# EAGLE schematic 7x7RGB-IR-J010129B (EAGLE 7.7.0)

## Sheet 1 of 2
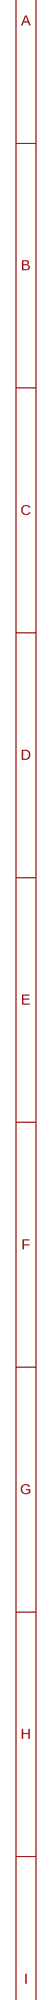
[diagram p0: schematic, sheet 1, part 1 of 2]
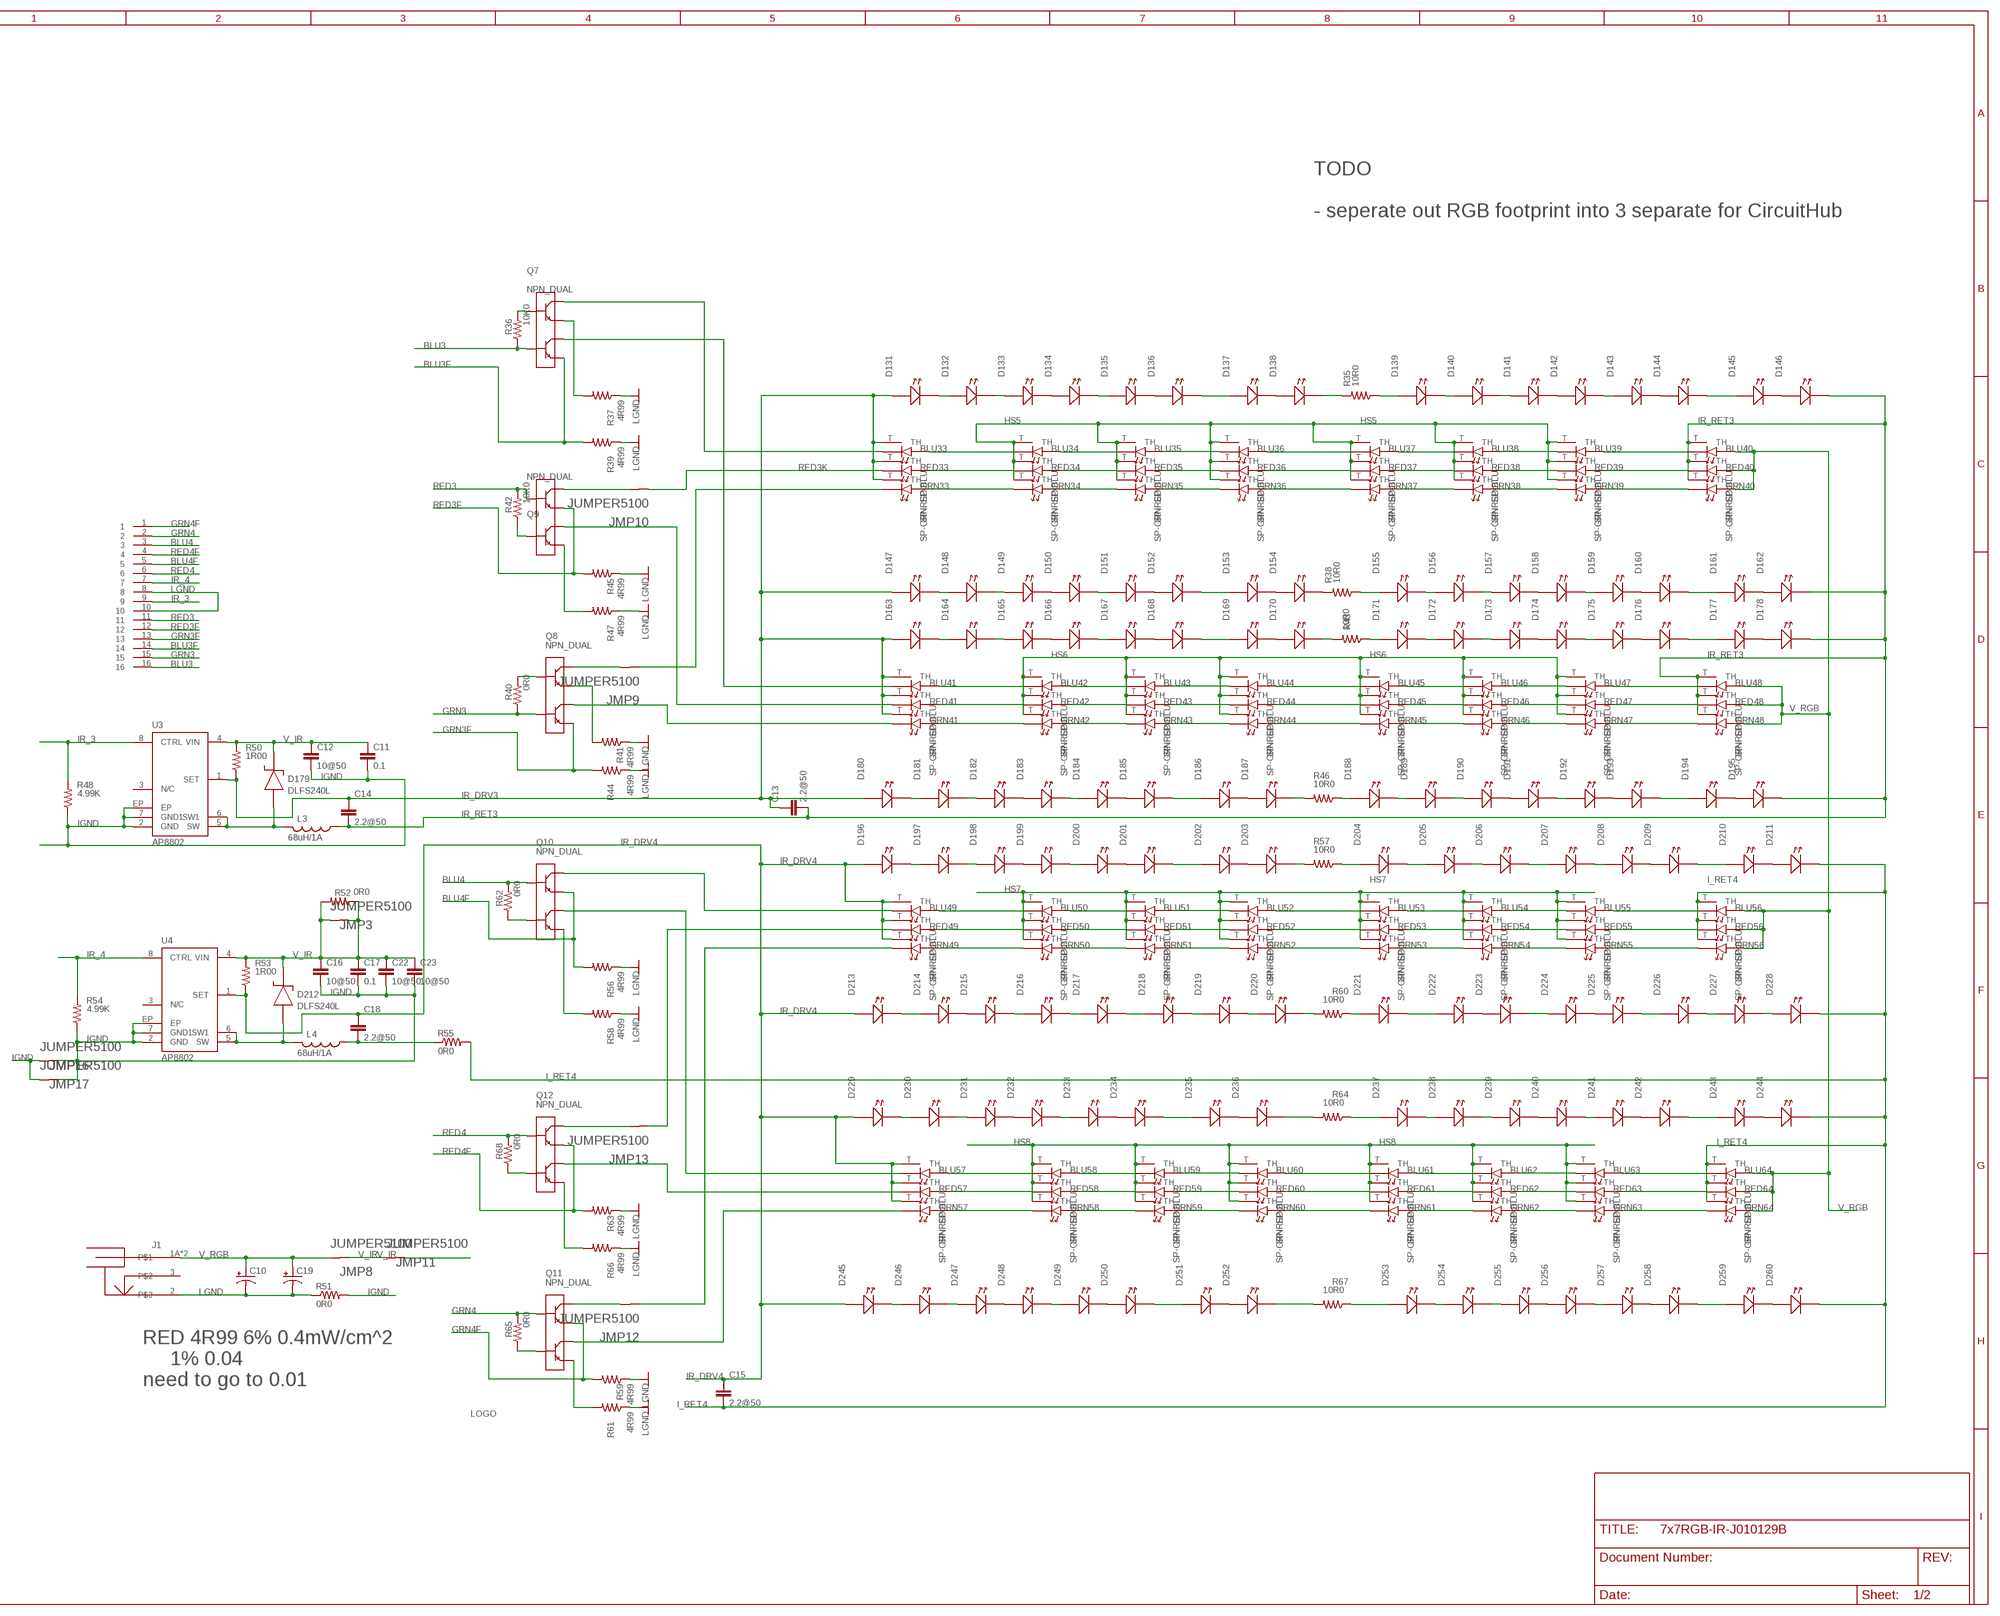
[diagram p1: schematic, sheet 1, part 2 of 2]

### Parts
BLU33  SP-BLU  LED-TH  [SUNPLUS-LED]
BLU34  SP-BLU  LED-TH  [SUNPLUS-LED]
BLU35  SP-BLU  LED-TH  [SUNPLUS-LED]
BLU36  SP-BLU  LED-TH  [SUNPLUS-LED]
BLU37  SP-BLU  LED-TH  [SUNPLUS-LED]
BLU38  SP-BLU  LED-TH  [SUNPLUS-LED]
BLU39  SP-BLU  LED-TH  [SUNPLUS-LED]
BLU40  SP-BLU  LED-TH  [SUNPLUS-LED]
BLU41  SP-BLU  LED-TH  [SUNPLUS-LED]
BLU42  SP-BLU  LED-TH  [SUNPLUS-LED]
BLU43  SP-BLU  LED-TH  [SUNPLUS-LED]
BLU44  SP-BLU  LED-TH  [SUNPLUS-LED]
BLU45  SP-BLU  LED-TH  [SUNPLUS-LED]
BLU46  SP-BLU  LED-TH  [SUNPLUS-LED]
BLU47  SP-BLU  LED-TH  [SUNPLUS-LED]
BLU48  SP-BLU  LED-TH  [SUNPLUS-LED]
BLU49  SP-BLU  LED-TH  [SUNPLUS-LED]
BLU50  SP-BLU  LED-TH  [SUNPLUS-LED]
BLU51  SP-BLU  LED-TH  [SUNPLUS-LED]
BLU52  SP-BLU  LED-TH  [SUNPLUS-LED]
BLU53  SP-BLU  LED-TH  [SUNPLUS-LED]
BLU54  SP-BLU  LED-TH  [SUNPLUS-LED]
BLU55  SP-BLU  LED-TH  [SUNPLUS-LED]
BLU56  SP-BLU  LED-TH  [SUNPLUS-LED]
BLU57  SP-BLU  LED-TH  [SUNPLUS-LED]
BLU58  SP-BLU  LED-TH  [SUNPLUS-LED]
BLU59  SP-BLU  LED-TH  [SUNPLUS-LED]
BLU60  SP-BLU  LED-TH  [SUNPLUS-LED]
BLU61  SP-BLU  LED-TH  [SUNPLUS-LED]
BLU62  SP-BLU  LED-TH  [SUNPLUS-LED]
BLU63  SP-BLU  LED-TH  [SUNPLUS-LED]
BLU64  SP-BLU  LED-TH  [SUNPLUS-LED]
C10  CPOL-US153CLV-0810  [153CLV-0810]
C11  0.1  CAPS0805S  [0805S]
C12  10@50  CAPS1210S  [1210S]
C13  2.2@50  CAPS1206S  [1206S]
C14  2.2@50  CAPS1206S  [1206S]
C15  2.2@50  CAPS1206S  [1206S]
C16  10@50  CAPS1210S  [1210S]
C17  0.1  CAPS0805S  [0805S]
C18  2.2@50  CAPS1206S  [1206S]
C19  CPOL-US153CLV-0810  [153CLV-0810]
C22  10@50  CAPS1210S  [1210S]
C23  10@50  CAPS1210S  [1210S]
D131  LEDLED_SFH4050  [LED_SFH4050]
D132  LEDLED_SFH4050  [LED_SFH4050]
D133  LEDLED_SFH4050  [LED_SFH4050]
D134  LEDLED_SFH4050  [LED_SFH4050]
D135  LEDLED_SFH4050  [LED_SFH4050]
D136  LEDLED_SFH4050  [LED_SFH4050]
D137  LEDLED_SFH4050  [LED_SFH4050]
D138  LEDLED_SFH4050  [LED_SFH4050]
D139  LEDLED_SFH4050  [LED_SFH4050]
D140  LEDLED_SFH4050  [LED_SFH4050]
D141  LEDLED_SFH4050  [LED_SFH4050]
D142  LEDLED_SFH4050  [LED_SFH4050]
D143  LEDLED_SFH4050  [LED_SFH4050]
D144  LEDLED_SFH4050  [LED_SFH4050]
D145  LEDLED_SFH4050  [LED_SFH4050]
D146  LEDLED_SFH4050  [LED_SFH4050]
D147  LEDLED_SFH4050  [LED_SFH4050]
D148  LEDLED_SFH4050  [LED_SFH4050]
D149  LEDLED_SFH4050  [LED_SFH4050]
D150  LEDLED_SFH4050  [LED_SFH4050]
D151  LEDLED_SFH4050  [LED_SFH4050]
D152  LEDLED_SFH4050  [LED_SFH4050]
D153  LEDLED_SFH4050  [LED_SFH4050]
D154  LEDLED_SFH4050  [LED_SFH4050]
D155  LEDLED_SFH4050  [LED_SFH4050]
D156  LEDLED_SFH4050  [LED_SFH4050]
D157  LEDLED_SFH4050  [LED_SFH4050]
D158  LEDLED_SFH4050  [LED_SFH4050]
D159  LEDLED_SFH4050  [LED_SFH4050]
D160  LEDLED_SFH4050  [LED_SFH4050]
D161  LEDLED_SFH4050  [LED_SFH4050]
D162  LEDLED_SFH4050  [LED_SFH4050]
D163  LEDLED_SFH4050  [LED_SFH4050]
D164  LEDLED_SFH4050  [LED_SFH4050]
D165  LEDLED_SFH4050  [LED_SFH4050]
D166  LEDLED_SFH4050  [LED_SFH4050]
D167  LEDLED_SFH4050  [LED_SFH4050]
D168  LEDLED_SFH4050  [LED_SFH4050]
D169  LEDLED_SFH4050  [LED_SFH4050]
D170  LEDLED_SFH4050  [LED_SFH4050]
D171  LEDLED_SFH4050  [LED_SFH4050]
D172  LEDLED_SFH4050  [LED_SFH4050]
D173  LEDLED_SFH4050  [LED_SFH4050]
D174  LEDLED_SFH4050  [LED_SFH4050]
D175  LEDLED_SFH4050  [LED_SFH4050]
D176  LEDLED_SFH4050  [LED_SFH4050]
D177  LEDLED_SFH4050  [LED_SFH4050]
D178  LEDLED_SFH4050  [LED_SFH4050]
D179  DLFS240L  DIODE_SCHOTTKYPWRDI-123  [PWRDI-123]
D180  LEDLED_SFH4050  [LED_SFH4050]
D181  LEDLED_SFH4050  [LED_SFH4050]
D182  LEDLED_SFH4050  [LED_SFH4050]
D183  LEDLED_SFH4050  [LED_SFH4050]
D184  LEDLED_SFH4050  [LED_SFH4050]
D185  LEDLED_SFH4050  [LED_SFH4050]
D186  LEDLED_SFH4050  [LED_SFH4050]
D187  LEDLED_SFH4050  [LED_SFH4050]
D188  LEDLED_SFH4050  [LED_SFH4050]
D189  LEDLED_SFH4050  [LED_SFH4050]
D190  LEDLED_SFH4050  [LED_SFH4050]
D191  LEDLED_SFH4050  [LED_SFH4050]
D192  LEDLED_SFH4050  [LED_SFH4050]
D193  LEDLED_SFH4050  [LED_SFH4050]
D194  LEDLED_SFH4050  [LED_SFH4050]
D195  LEDLED_SFH4050  [LED_SFH4050]
D196  LEDLED_SFH4050  [LED_SFH4050]
D197  LEDLED_SFH4050  [LED_SFH4050]
D198  LEDLED_SFH4050  [LED_SFH4050]
D199  LEDLED_SFH4050  [LED_SFH4050]
D200  LEDLED_SFH4050  [LED_SFH4050]
D201  LEDLED_SFH4050  [LED_SFH4050]
D202  LEDLED_SFH4050  [LED_SFH4050]
D203  LEDLED_SFH4050  [LED_SFH4050]
D204  LEDLED_SFH4050  [LED_SFH4050]
D205  LEDLED_SFH4050  [LED_SFH4050]
D206  LEDLED_SFH4050  [LED_SFH4050]
D207  LEDLED_SFH4050  [LED_SFH4050]
D208  LEDLED_SFH4050  [LED_SFH4050]
D209  LEDLED_SFH4050  [LED_SFH4050]
D210  LEDLED_SFH4050  [LED_SFH4050]
D211  LEDLED_SFH4050  [LED_SFH4050]
D212  DLFS240L  DIODE_SCHOTTKYPWRDI-123  [PWRDI-123]
D213  LEDLED_SFH4050  [LED_SFH4050]
D214  LEDLED_SFH4050  [LED_SFH4050]
D215  LEDLED_SFH4050  [LED_SFH4050]
D216  LEDLED_SFH4050  [LED_SFH4050]
D217  LEDLED_SFH4050  [LED_SFH4050]
D218  LEDLED_SFH4050  [LED_SFH4050]
D219  LEDLED_SFH4050  [LED_SFH4050]
D220  LEDLED_SFH4050  [LED_SFH4050]
D221  LEDLED_SFH4050  [LED_SFH4050]
D222  LEDLED_SFH4050  [LED_SFH4050]
D223  LEDLED_SFH4050  [LED_SFH4050]
D224  LEDLED_SFH4050  [LED_SFH4050]
D225  LEDLED_SFH4050  [LED_SFH4050]
D226  LEDLED_SFH4050  [LED_SFH4050]
D227  LEDLED_SFH4050  [LED_SFH4050]
D228  LEDLED_SFH4050  [LED_SFH4050]
D229  LEDLED_SFH4050  [LED_SFH4050]
D230  LEDLED_SFH4050  [LED_SFH4050]
D231  LEDLED_SFH4050  [LED_SFH4050]
D232  LEDLED_SFH4050  [LED_SFH4050]
D233  LEDLED_SFH4050  [LED_SFH4050]
D234  LEDLED_SFH4050  [LED_SFH4050]
D235  LEDLED_SFH4050  [LED_SFH4050]
D236  LEDLED_SFH4050  [LED_SFH4050]
D237  LEDLED_SFH4050  [LED_SFH4050]
D238  LEDLED_SFH4050  [LED_SFH4050]
D239  LEDLED_SFH4050  [LED_SFH4050]
D240  LEDLED_SFH4050  [LED_SFH4050]
D241  LEDLED_SFH4050  [LED_SFH4050]
D242  LEDLED_SFH4050  [LED_SFH4050]
D243  LEDLED_SFH4050  [LED_SFH4050]
D244  LEDLED_SFH4050  [LED_SFH4050]
D245  LEDLED_SFH4050  [LED_SFH4050]
D246  LEDLED_SFH4050  [LED_SFH4050]
D247  LEDLED_SFH4050  [LED_SFH4050]
D248  LEDLED_SFH4050  [LED_SFH4050]
D249  LEDLED_SFH4050  [LED_SFH4050]
D250  LEDLED_SFH4050  [LED_SFH4050]
D251  LEDLED_SFH4050  [LED_SFH4050]
D252  LEDLED_SFH4050  [LED_SFH4050]
D253  LEDLED_SFH4050  [LED_SFH4050]
D254  LEDLED_SFH4050  [LED_SFH4050]
D255  LEDLED_SFH4050  [LED_SFH4050]
D256  LEDLED_SFH4050  [LED_SFH4050]
D257  LEDLED_SFH4050  [LED_SFH4050]
D258  LEDLED_SFH4050  [LED_SFH4050]
D259  LEDLED_SFH4050  [LED_SFH4050]
D260  LEDLED_SFH4050  [LED_SFH4050]
GRN33  SP-GRN  LED-TH  [SUNPLUS-LED]
GRN34  SP-GRN  LED-TH  [SUNPLUS-LED]
GRN35  SP-GRN  LED-TH  [SUNPLUS-LED]
GRN36  SP-GRN  LED-TH  [SUNPLUS-LED]
GRN37  SP-GRN  LED-TH  [SUNPLUS-LED]
GRN38  SP-GRN  LED-TH  [SUNPLUS-LED]
GRN39  SP-GRN  LED-TH  [SUNPLUS-LED]
GRN40  SP-GRN  LED-TH  [SUNPLUS-LED]
GRN41  SP-GRN  LED-TH  [SUNPLUS-LED]
GRN42  SP-GRN  LED-TH  [SUNPLUS-LED]
GRN43  SP-GRN  LED-TH  [SUNPLUS-LED]
GRN44  SP-GRN  LED-TH  [SUNPLUS-LED]
GRN45  SP-GRN  LED-TH  [SUNPLUS-LED]
GRN46  SP-GRN  LED-TH  [SUNPLUS-LED]
GRN47  SP-GRN  LED-TH  [SUNPLUS-LED]
GRN48  SP-GRN  LED-TH  [SUNPLUS-LED]
GRN49  SP-GRN  LED-TH  [SUNPLUS-LED]
GRN50  SP-GRN  LED-TH  [SUNPLUS-LED]
GRN51  SP-GRN  LED-TH  [SUNPLUS-LED]
GRN52  SP-GRN  LED-TH  [SUNPLUS-LED]
GRN53  SP-GRN  LED-TH  [SUNPLUS-LED]
GRN54  SP-GRN  LED-TH  [SUNPLUS-LED]
GRN55  SP-GRN  LED-TH  [SUNPLUS-LED]
GRN56  SP-GRN  LED-TH  [SUNPLUS-LED]
GRN57  SP-GRN  LED-TH  [SUNPLUS-LED]
GRN58  SP-GRN  LED-TH  [SUNPLUS-LED]
GRN59  SP-GRN  LED-TH  [SUNPLUS-LED]
GRN60  SP-GRN  LED-TH  [SUNPLUS-LED]
GRN61  SP-GRN  LED-TH  [SUNPLUS-LED]
GRN62  SP-GRN  LED-TH  [SUNPLUS-LED]
GRN63  SP-GRN  LED-TH  [SUNPLUS-LED]
GRN64  SP-GRN  LED-TH  [SUNPLUS-LED]
J1  POWER_JACK_SHUNTPJ-002  [PJ-002]
JMP3  JUMPER5100  [5100]
JMP8  JUMPER5100  [5100]
JMP9  JUMPER5100  [5100]
JMP10  JUMPER5100  [5100]
JMP11  JUMPER5100  [5100]
JMP12  JUMPER5100  [5100]
JMP13  JUMPER5100  [5100]
JMP16  JUMPER5100  [5100]
JMP17  JUMPER5100  [5100]
L3  68uH/1A  INDUCTOR_SMSRU8043  [SRU8043]
L4  68uH/1A  INDUCTOR_SMSRU8043  [SRU8043]
P2  CON162X8SM-SMALL  [HEADER2X8_SM_SMALL]
Q7  NPN_DUAL  [LFPAK56D]
Q8  NPN_DUAL  [LFPAK56D]
Q9  NPN_DUAL  [LFPAK56D]
Q10  NPN_DUAL  [LFPAK56D]
Q11  NPN_DUAL  [LFPAK56D]
Q12  NPN_DUAL  [LFPAK56D]
R35  10R0  RESISTOR_SM1206S  [1206S]
R36  10K0  RESISTOR_SM1206S  [1206S]
R37  4R99  R-US_R2512  [R2512]
R38  10R0  RESISTOR_SM1206S  [1206S]
R39  4R99  R-US_R2512  [R2512]
R40  0R0  RESISTOR_SM1206S  [1206S]
R41  4R99  R-US_R2512  [R2512]
R42  10K0  RESISTOR_SM1206S  [1206S]
R43  10R0  RESISTOR_SM1206S  [1206S]
R44  4R99  R-US_R2512  [R2512]
R45  4R99  R-US_R2512  [R2512]
R46  10R0  RESISTOR_SM1206S  [1206S]
R47  4R99  R-US_R2512  [R2512]
R48  4.99K  RESISTOR_SM0805S  [0805S]
R50  1R00  RESISTOR_SM1206S  [1206S]
R51  0R0  RESISTOR_SM1206S  [1206S]
R52  0R0  RESISTOR_SM1206S  [1206S]
R53  1R00  RESISTOR_SM1206S  [1206S]
R54  4.99K  RESISTOR_SM0805S  [0805S]
R55  0R0  RESISTOR_SM1206S  [1206S]
R56  4R99  R-US_R2512  [R2512]
R57  10R0  RESISTOR_SM1206S  [1206S]
R58  4R99  R-US_R2512  [R2512]
R59  4R99  R-US_R2512  [R2512]
R60  10R0  RESISTOR_SM1206S  [1206S]
R61  4R99  R-US_R2512  [R2512]
R62  0R0  RESISTOR_SM1206S  [1206S]
R63  4R99  R-US_R2512  [R2512]
R64  10R0  RESISTOR_SM1206S  [1206S]
R65  0R0  RESISTOR_SM1206S  [1206S]
R66  4R99  R-US_R2512  [R2512]
R67  10R0  RESISTOR_SM1206S  [1206S]
R68  0R0  RESISTOR_SM1206S  [1206S]
RED33  SP-RED  LED-TH  [SUNPLUS-LED]
RED34  SP-RED  LED-TH  [SUNPLUS-LED]
RED35  SP-RED  LED-TH  [SUNPLUS-LED]
RED36  SP-RED  LED-TH  [SUNPLUS-LED]
RED37  SP-RED  LED-TH  [SUNPLUS-LED]
RED38  SP-RED  LED-TH  [SUNPLUS-LED]
RED39  SP-RED  LED-TH  [SUNPLUS-LED]
RED40  SP-RED  LED-TH  [SUNPLUS-LED]
RED41  SP-RED  LED-TH  [SUNPLUS-LED]
RED42  SP-RED  LED-TH  [SUNPLUS-LED]
RED43  SP-RED  LED-TH  [SUNPLUS-LED]
RED44  SP-RED  LED-TH  [SUNPLUS-LED]
RED45  SP-RED  LED-TH  [SUNPLUS-LED]
RED46  SP-RED  LED-TH  [SUNPLUS-LED]
RED47  SP-RED  LED-TH  [SUNPLUS-LED]
RED48  SP-RED  LED-TH  [SUNPLUS-LED]
RED49  SP-RED  LED-TH  [SUNPLUS-LED]
RED50  SP-RED  LED-TH  [SUNPLUS-LED]
RED51  SP-RED  LED-TH  [SUNPLUS-LED]
RED52  SP-RED  LED-TH  [SUNPLUS-LED]
RED53  SP-RED  LED-TH  [SUNPLUS-LED]
RED54  SP-RED  LED-TH  [SUNPLUS-LED]
RED55  SP-RED  LED-TH  [SUNPLUS-LED]
RED56  SP-RED  LED-TH  [SUNPLUS-LED]
RED57  SP-RED  LED-TH  [SUNPLUS-LED]
RED58  SP-RED  LED-TH  [SUNPLUS-LED]
RED59  SP-RED  LED-TH  [SUNPLUS-LED]
RED60  SP-RED  LED-TH  [SUNPLUS-LED]
RED61  SP-RED  LED-TH  [SUNPLUS-LED]
RED62  SP-RED  LED-TH  [SUNPLUS-LED]
RED63  SP-RED  LED-TH  [SUNPLUS-LED]
RED64  SP-RED  LED-TH  [SUNPLUS-LED]
U3  AP8802  [SOIC8-EP]
U4  AP8802  [SOIC8-EP]
U$19  JFRC-LOGOLOGO_OP  [LOGO_BMP_OP]

### Nets
BLU3: P2.16 Q7.4(B2) R36.1
BLU3F: P2.14 Q7.3(E2) R39.2
BLU3K: BLU33.GC(K) Q7.7(C1) Q7.8(C1) Q7.78(C1)
BLU4: P2.3 Q10.2(B1) R62.2
BLU4F: P2.5 Q10.1(E1) R56.2
G4: Q11.3(E2) R61.2
G4A: Q11.4(B2) R65.1
GRN3: P2.15 Q8.4(B2) R40.1
GRN3F: P2.13 Q8.3(E2) R44.2
GRN3K: GRN33.GC(K) JMP9.1
GRN4: P2.2 Q11.2(B1) R65.2
GRN4F: P2.1 Q11.1(E1) R59.2
GULA_1: GRN57.GC(K) Q11.5(C2) Q11.6(C2) Q11.56(C2)
GULA_2: Q12.5(C2) Q12.6(C2) Q12.56(C2) RED57.GC(K)
GULA_3: GRN41.GC(K) Q8.5(C2) Q8.6(C2) Q8.56(C2)
GULA_4: Q9.5(C2) Q9.6(C2) Q9.56(C2) RED41.GC(K)
HS5: BLU34.T(TH) BLU35.T(TH) BLU36.T(TH) BLU37.T(TH) BLU38.T(TH) BLU39.T(TH) GRN34.T(TH) GRN35.T(TH) GRN36.T(TH) GRN37.T(TH) GRN38.T(TH) GRN39.T(TH) RED34.T(TH) RED35.T(TH) RED36.T(TH) RED37.T(TH) RED38.T(TH) RED39.T(TH)
HS6: BLU42.T(TH) BLU43.T(TH) BLU44.T(TH) BLU45.T(TH) BLU46.T(TH) BLU47.T(TH) GRN42.T(TH) GRN43.T(TH) GRN44.T(TH) GRN45.T(TH) GRN46.T(TH) GRN47.T(TH) RED42.T(TH) RED43.T(TH) RED44.T(TH) RED45.T(TH) RED46.T(TH) RED47.T(TH)
HS7: BLU50.T(TH) BLU51.T(TH) BLU52.T(TH) BLU53.T(TH) BLU54.T(TH) BLU55.T(TH) GRN50.T(TH) GRN51.T(TH) GRN52.T(TH) GRN53.T(TH) GRN54.T(TH) GRN55.T(TH) RED50.T(TH) RED51.T(TH) RED52.T(TH) RED53.T(TH) RED54.T(TH) RED55.T(TH)
HS8: BLU58.T(TH) BLU59.T(TH) BLU60.T(TH) BLU61.T(TH) BLU62.T(TH) BLU63.T(TH) GRN58.T(TH) GRN59.T(TH) GRN60.T(TH) GRN61.T(TH) GRN62.T(TH) GRN63.T(TH) RED58.T(TH) RED59.T(TH) RED60.T(TH) RED61.T(TH) RED62.T(TH) RED63.T(TH)
I_RET4: BLU56.T(TH) BLU64.T(TH) C15.2 D211.C(K) D228.C(K) D244.C(K) D260.C(K) GRN56.T(TH) GRN64.T(TH) R55.2 RED56.T(TH) RED64.T(TH)
IGND: C11.2 C12.2 C16.2 C17.2 C22.2 C23.2 JMP16.1 JMP16.2 JMP17.1 JMP17.2 R48.1 R51.2 R54.1 U3.2(GND) U3.7(GND1) U3.EP U4.2(GND) U4.7(GND1) U4.EP
IR_3: P2.9 R48.2 U3.8(CTRL)
IR_4: P2.7 R54.2 U4.8(CTRL)
IR_DRV3: BLU33.T(TH) BLU41.T(TH) C13.1 C14.1 D131.A D147.A D163.A D180.A GRN33.T(TH) GRN41.T(TH) R50.1 RED33.T(TH) RED41.T(TH) U3.1(SET)
IR_DRV4: BLU49.T(TH) BLU57.T(TH) C15.1 C18.1 D196.A D213.A D229.A D245.A GRN49.T(TH) GRN57.T(TH) R53.1 RED49.T(TH) RED57.T(TH) U4.1(SET)
IR_RET3: BLU40.T(TH) BLU48.T(TH) C13.2 C14.2 D146.C(K) D162.C(K) D178.C(K) D195.C(K) GRN40.T(TH) GRN48.T(TH) L3.1 RED40.T(TH) RED48.T(TH)
LGND: C10.- C19.- J1.2 P2.8 P2.10 R37.1 R39.1 R41.1 R44.1 R45.1 R47.1 R51.1 R56.1 R58.1 R59.1 R61.1 R63.1 R66.1 ; also sheet 2
N$2: D227.C(K) D228.A
N$3: Q12.4(B2) R68.1
N$4: Q8.1(E1) R41.2
N$5: GRN49.GC(K) JMP12.1
N$6: BLU49.GC(K) Q10.7(C1) Q10.8(C1) Q10.78(C1)
N$8: BLU57.GC(K) Q10.5(C2) Q10.6(C2) Q10.56(C2)
N$9: Q9.3(E2) R47.2
N$10: Q9.4(B2) R42.1
N$11: Q8.2(B1) R40.2
N$14: D139.A R35.1
N$15: JMP13.2 Q12.7(C1) Q12.8(C1) Q12.78(C1)
N$16: JMP12.2 Q11.7(C1) Q11.8(C1) Q11.78(C1)
N$17: D138.C(K) R35.2
N$18: D154.C(K) R38.2
N$19: D155.A R38.1
N$20: JMP13.1 RED49.GC(K)
N$21: D171.A R43.1
N$22: D170.C(K) R43.2
N$23: D188.A R46.1
N$24: D187.C(K) R46.2
N$25: D203.C(K) R57.2
N$26: GRN58.GA(A) GRN59.GC(K)
N$27: D212.A L4.2 U4.5(SW) U4.6(SW1)
N$29: C18.2 L4.1 R55.1
N$30: GRN57.GA(A) GRN58.GC(K)
N$31: D204.A R57.1
N$32: D221.A R60.1
N$33: D220.C(K) R60.2
N$34: D237.A R64.1
N$35: Q10.4(B2) R62.1
N$36: Q10.3(E2) R58.2
N$37: D236.C(K) R64.2
N$38: D253.A R67.1
N$39: D252.C(K) R67.2
N$67: D179.A L3.2 U3.5(SW) U3.6(SW1)
N$97: GRN42.GA(A) GRN43.GC(K)
N$177: GRN41.GA(A) GRN42.GC(K)
N$178: RED42.GA(A) RED43.GC(K)
N$179: RED41.GA(A) RED42.GC(K)
N$181: BLU41.GA(A) BLU42.GC(K)
N$188: BLU42.GA(A) BLU43.GC(K)
N$190: RED58.GA(A) RED59.GC(K)
N$208: GRN34.GA(A) GRN35.GC(K)
N$230: GRN45.GA(A) GRN46.GC(K)
N$233: GRN44.GA(A) GRN45.GC(K)
N$235: RED45.GA(A) RED46.GC(K)
N$238: RED44.GA(A) RED45.GC(K)
N$239: BLU44.GA(A) BLU45.GC(K)
N$240: BLU45.GA(A) BLU46.GC(K)
N$241: GRN47.GA(A) GRN48.GC(K)
N$242: RED47.GA(A) RED48.GC(K)
N$243: BLU47.GA(A) BLU48.GC(K)
N$244: BLU43.GA(A) BLU44.GC(K)
N$245: RED43.GA(A) RED44.GC(K)
N$248: GRN43.GA(A) GRN44.GC(K)
N$249: GRN50.GA(A) GRN51.GC(K)
N$250: BLU46.GA(A) BLU47.GC(K)
N$251: RED46.GA(A) RED47.GC(K)
N$256: D181.C(K) D182.A
N$257: D182.C(K) D183.A
N$261: GRN33.GA(A) GRN34.GC(K)
N$262: RED34.GA(A) RED35.GC(K)
N$264: D184.C(K) D185.A
N$265: D186.C(K) D187.A
N$267: RED33.GA(A) RED34.GC(K)
N$268: D180.C(K) D181.A
N$269: D183.C(K) D184.A
N$270: D185.C(K) D186.A
N$271: D189.C(K) D190.A
N$272: D190.C(K) D191.A
N$273: D192.C(K) D193.A
N$274: D194.C(K) D195.A
N$275: D188.C(K) D189.A
N$276: D191.C(K) D192.A
N$277: D193.C(K) D194.A
N$278: D164.C(K) D165.A
N$279: D165.C(K) D166.A
N$280: D167.C(K) D168.A
N$281: D169.C(K) D170.A
N$282: D163.C(K) D164.A
N$283: D166.C(K) D167.A
N$284: D168.C(K) D169.A
N$285: D172.C(K) D173.A
N$286: D173.C(K) D174.A
N$287: D175.C(K) D176.A
N$288: D177.C(K) D178.A
N$289: D171.C(K) D172.A
N$290: D174.C(K) D175.A
N$291: D176.C(K) D177.A
N$292: BLU33.GA(A) BLU34.GC(K)
N$294: GRN49.GA(A) GRN50.GC(K)
N$295: RED50.GA(A) RED51.GC(K)
N$296: RED49.GA(A) RED50.GC(K)
N$297: BLU49.GA(A) BLU50.GC(K)
N$298: BLU50.GA(A) BLU51.GC(K)
N$299: GRN53.GA(A) GRN54.GC(K)
N$300: GRN52.GA(A) GRN53.GC(K)
N$301: RED53.GA(A) RED54.GC(K)
N$302: RED52.GA(A) RED53.GC(K)
N$303: BLU52.GA(A) BLU53.GC(K)
N$304: BLU53.GA(A) BLU54.GC(K)
N$305: GRN55.GA(A) GRN56.GC(K)
N$306: RED55.GA(A) RED56.GC(K)
N$307: BLU55.GA(A) BLU56.GC(K)
N$308: BLU51.GA(A) BLU52.GC(K)
N$309: RED51.GA(A) RED52.GC(K)
N$310: GRN51.GA(A) GRN52.GC(K)
N$311: RED57.GA(A) RED58.GC(K)
N$312: BLU54.GA(A) BLU55.GC(K)
N$313: RED54.GA(A) RED55.GC(K)
N$314: GRN54.GA(A) GRN55.GC(K)
N$315: D197.C(K) D198.A
N$316: D198.C(K) D199.A
N$317: D200.C(K) D201.A
N$318: D202.C(K) D203.A
N$319: D196.C(K) D197.A
N$320: D199.C(K) D200.A
N$321: D201.C(K) D202.A
N$322: D205.C(K) D206.A
N$323: D206.C(K) D207.A
N$324: D208.C(K) D209.A
N$325: D210.C(K) D211.A
N$326: D204.C(K) D205.A
N$327: D207.C(K) D208.A
N$328: D209.C(K) D210.A
N$329: D214.C(K) D215.A
N$330: D215.C(K) D216.A
N$331: D217.C(K) D218.A
N$332: D219.C(K) D220.A
N$333: D213.C(K) D214.A
N$334: D216.C(K) D217.A
N$335: D218.C(K) D219.A
N$336: D222.C(K) D223.A
N$337: D224.C(K) D225.A
N$338: D226.C(K) D227.A
N$339: D221.C(K) D222.A
N$340: D223.C(K) D224.A
N$341: D225.C(K) D226.A
N$344: BLU34.GA(A) BLU35.GC(K)
N$345: GRN37.GA(A) GRN38.GC(K)
N$346: GRN36.GA(A) GRN37.GC(K)
N$347: RED37.GA(A) RED38.GC(K)
N$348: RED36.GA(A) RED37.GC(K)
N$349: BLU36.GA(A) BLU37.GC(K)
N$350: BLU37.GA(A) BLU38.GC(K)
N$351: GRN39.GA(A) GRN40.GC(K)
N$352: RED39.GA(A) RED40.GC(K)
N$353: BLU39.GA(A) BLU40.GC(K)
N$354: BLU35.GA(A) BLU36.GC(K)
N$355: RED35.GA(A) RED36.GC(K)
N$356: GRN35.GA(A) GRN36.GC(K)
N$357: GRN46.GA(A) GRN47.GC(K)
N$358: BLU38.GA(A) BLU39.GC(K)
N$359: RED38.GA(A) RED39.GC(K)
N$360: GRN38.GA(A) GRN39.GC(K)
N$361: BLU57.GA(A) BLU58.GC(K)
N$362: BLU58.GA(A) BLU59.GC(K)
N$363: GRN61.GA(A) GRN62.GC(K)
N$364: GRN60.GA(A) GRN61.GC(K)
N$365: D132.C(K) D133.A
N$366: D133.C(K) D134.A
N$367: D135.C(K) D136.A
N$368: D137.C(K) D138.A
N$369: D131.C(K) D132.A
N$370: D134.C(K) D135.A
N$371: D136.C(K) D137.A
N$372: D140.C(K) D141.A
N$373: D141.C(K) D142.A
N$374: D143.C(K) D144.A
N$375: D145.C(K) D146.A
N$376: D139.C(K) D140.A
N$377: D142.C(K) D143.A
N$378: D144.C(K) D145.A
N$379: D148.C(K) D149.A
N$380: D149.C(K) D150.A
N$381: D151.C(K) D152.A
N$382: D153.C(K) D154.A
N$383: D147.C(K) D148.A
N$384: D150.C(K) D151.A
N$385: D152.C(K) D153.A
N$386: D156.C(K) D157.A
N$387: D157.C(K) D158.A
N$388: D159.C(K) D160.A
N$389: D161.C(K) D162.A
N$390: D155.C(K) D156.A
N$391: D158.C(K) D159.A
N$392: D160.C(K) D161.A
N$400: Q7.1(E1) R37.2
N$401: BLU41.GC(K) Q7.5(C2) Q7.6(C2) Q7.56(C2)
N$403: RED61.GA(A) RED62.GC(K)
N$404: RED60.GA(A) RED61.GC(K)
N$405: BLU60.GA(A) BLU61.GC(K)
N$406: BLU61.GA(A) BLU62.GC(K)
N$407: GRN63.GA(A) GRN64.GC(K)
N$408: RED63.GA(A) RED64.GC(K)
N$409: BLU63.GA(A) BLU64.GC(K)
N$410: BLU59.GA(A) BLU60.GC(K)
N$411: RED59.GA(A) RED60.GC(K)
N$412: GRN59.GA(A) GRN60.GC(K)
N$414: BLU62.GA(A) BLU63.GC(K)
N$415: RED62.GA(A) RED63.GC(K)
N$416: GRN62.GA(A) GRN63.GC(K)
N$424: D230.C(K) D231.A
N$425: D231.C(K) D232.A
N$426: D233.C(K) D234.A
N$427: D235.C(K) D236.A
N$428: D229.C(K) D230.A
N$429: D232.C(K) D233.A
N$430: D234.C(K) D235.A
N$431: D238.C(K) D239.A
N$432: D239.C(K) D240.A
N$433: D241.C(K) D242.A
N$434: D243.C(K) D244.A
N$435: D237.C(K) D238.A
N$436: D240.C(K) D241.A
N$437: D242.C(K) D243.A
N$438: D246.C(K) D247.A
N$439: D247.C(K) D248.A
N$440: D249.C(K) D250.A
N$441: D251.C(K) D252.A
N$442: D245.C(K) D246.A
N$443: D248.C(K) D249.A
N$444: D250.C(K) D251.A
N$445: D254.C(K) D255.A
N$446: D255.C(K) D256.A
N$447: D257.C(K) D258.A
N$448: D259.C(K) D260.A
N$449: D253.C(K) D254.A
N$450: D256.C(K) D257.A
N$451: D258.C(K) D259.A
N$481: JMP10.2 Q9.7(C1) Q9.8(C1) Q9.78(C1)
N$482: JMP9.2 Q8.7(C1) Q8.8(C1) Q8.78(C1)
N$484: Q7.2(B1) R36.2
R4: Q12.3(E2) R66.2
RED3: P2.11 Q9.2(B1) R42.2
RED3F: P2.12 Q9.1(E1) R45.2
RED3K: JMP10.1 RED33.GC(K)
RED4: P2.6 Q12.2(B1) R68.2
RED4F: P2.4 Q12.1(E1) R63.2
V_IR: C11.1 C12.1 C16.1 C17.1 C22.1 C23.1 D179.K D212.K JMP3.1 JMP3.2 JMP8.2 JMP11.1 JMP11.2 R50.2 R52.1 R52.2 R53.2 U3.4(VIN) U4.4(VIN)
V_RGB: BLU40.GA(A) BLU48.GA(A) BLU56.GA(A) BLU64.GA(A) C10.+ C19.+ GRN40.GA(A) GRN48.GA(A) GRN56.GA(A) GRN64.GA(A) J1.1A J1.1B JMP8.1 RED40.GA(A) RED48.GA(A) RED56.GA(A) RED64.GA(A) ; also sheet 2
Unconnected: J1.3 U3.3(N/C) U4.3(N/C)

### Notes on the sheet
- TODO
  
  - seperate out RGB footprint into 3 separate for CircuitHub
- RED 4R99 6% 0.4mW/cm^2
       1% 0.04
  need to go to 0.01

## Sheet 2 of 2
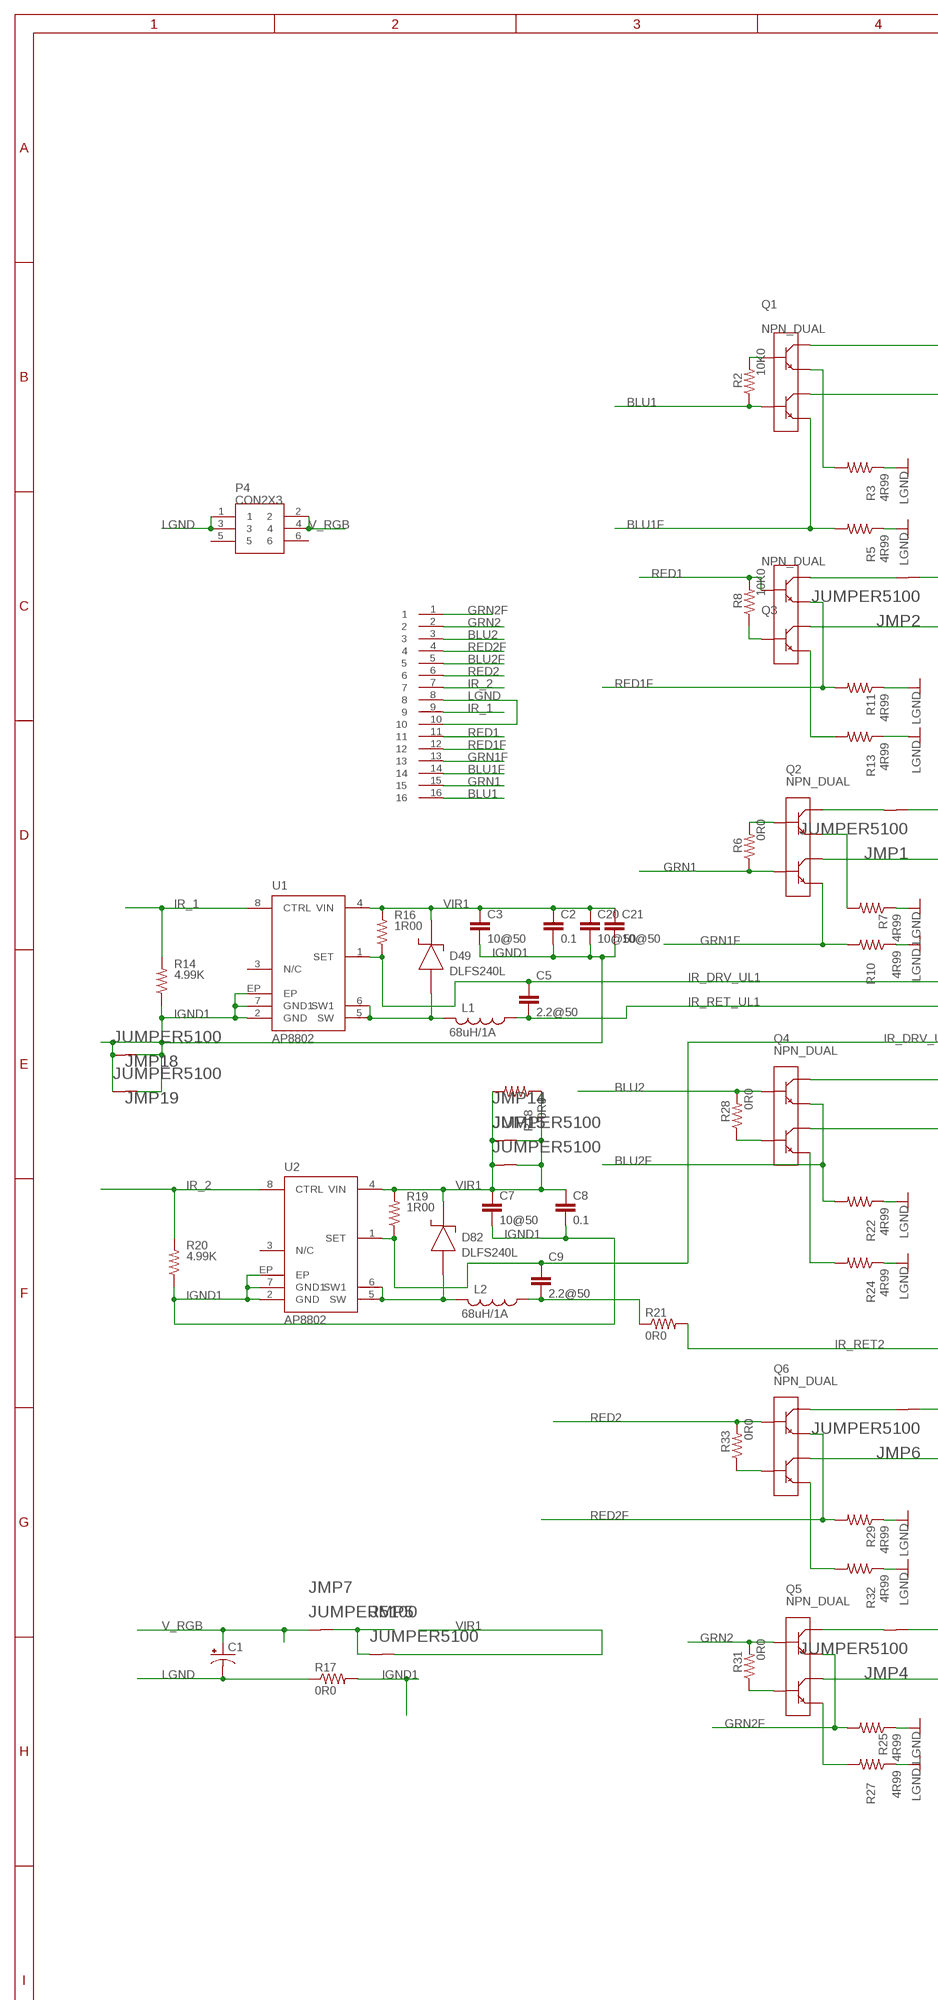
[diagram p2: schematic, sheet 2, part 1 of 2]
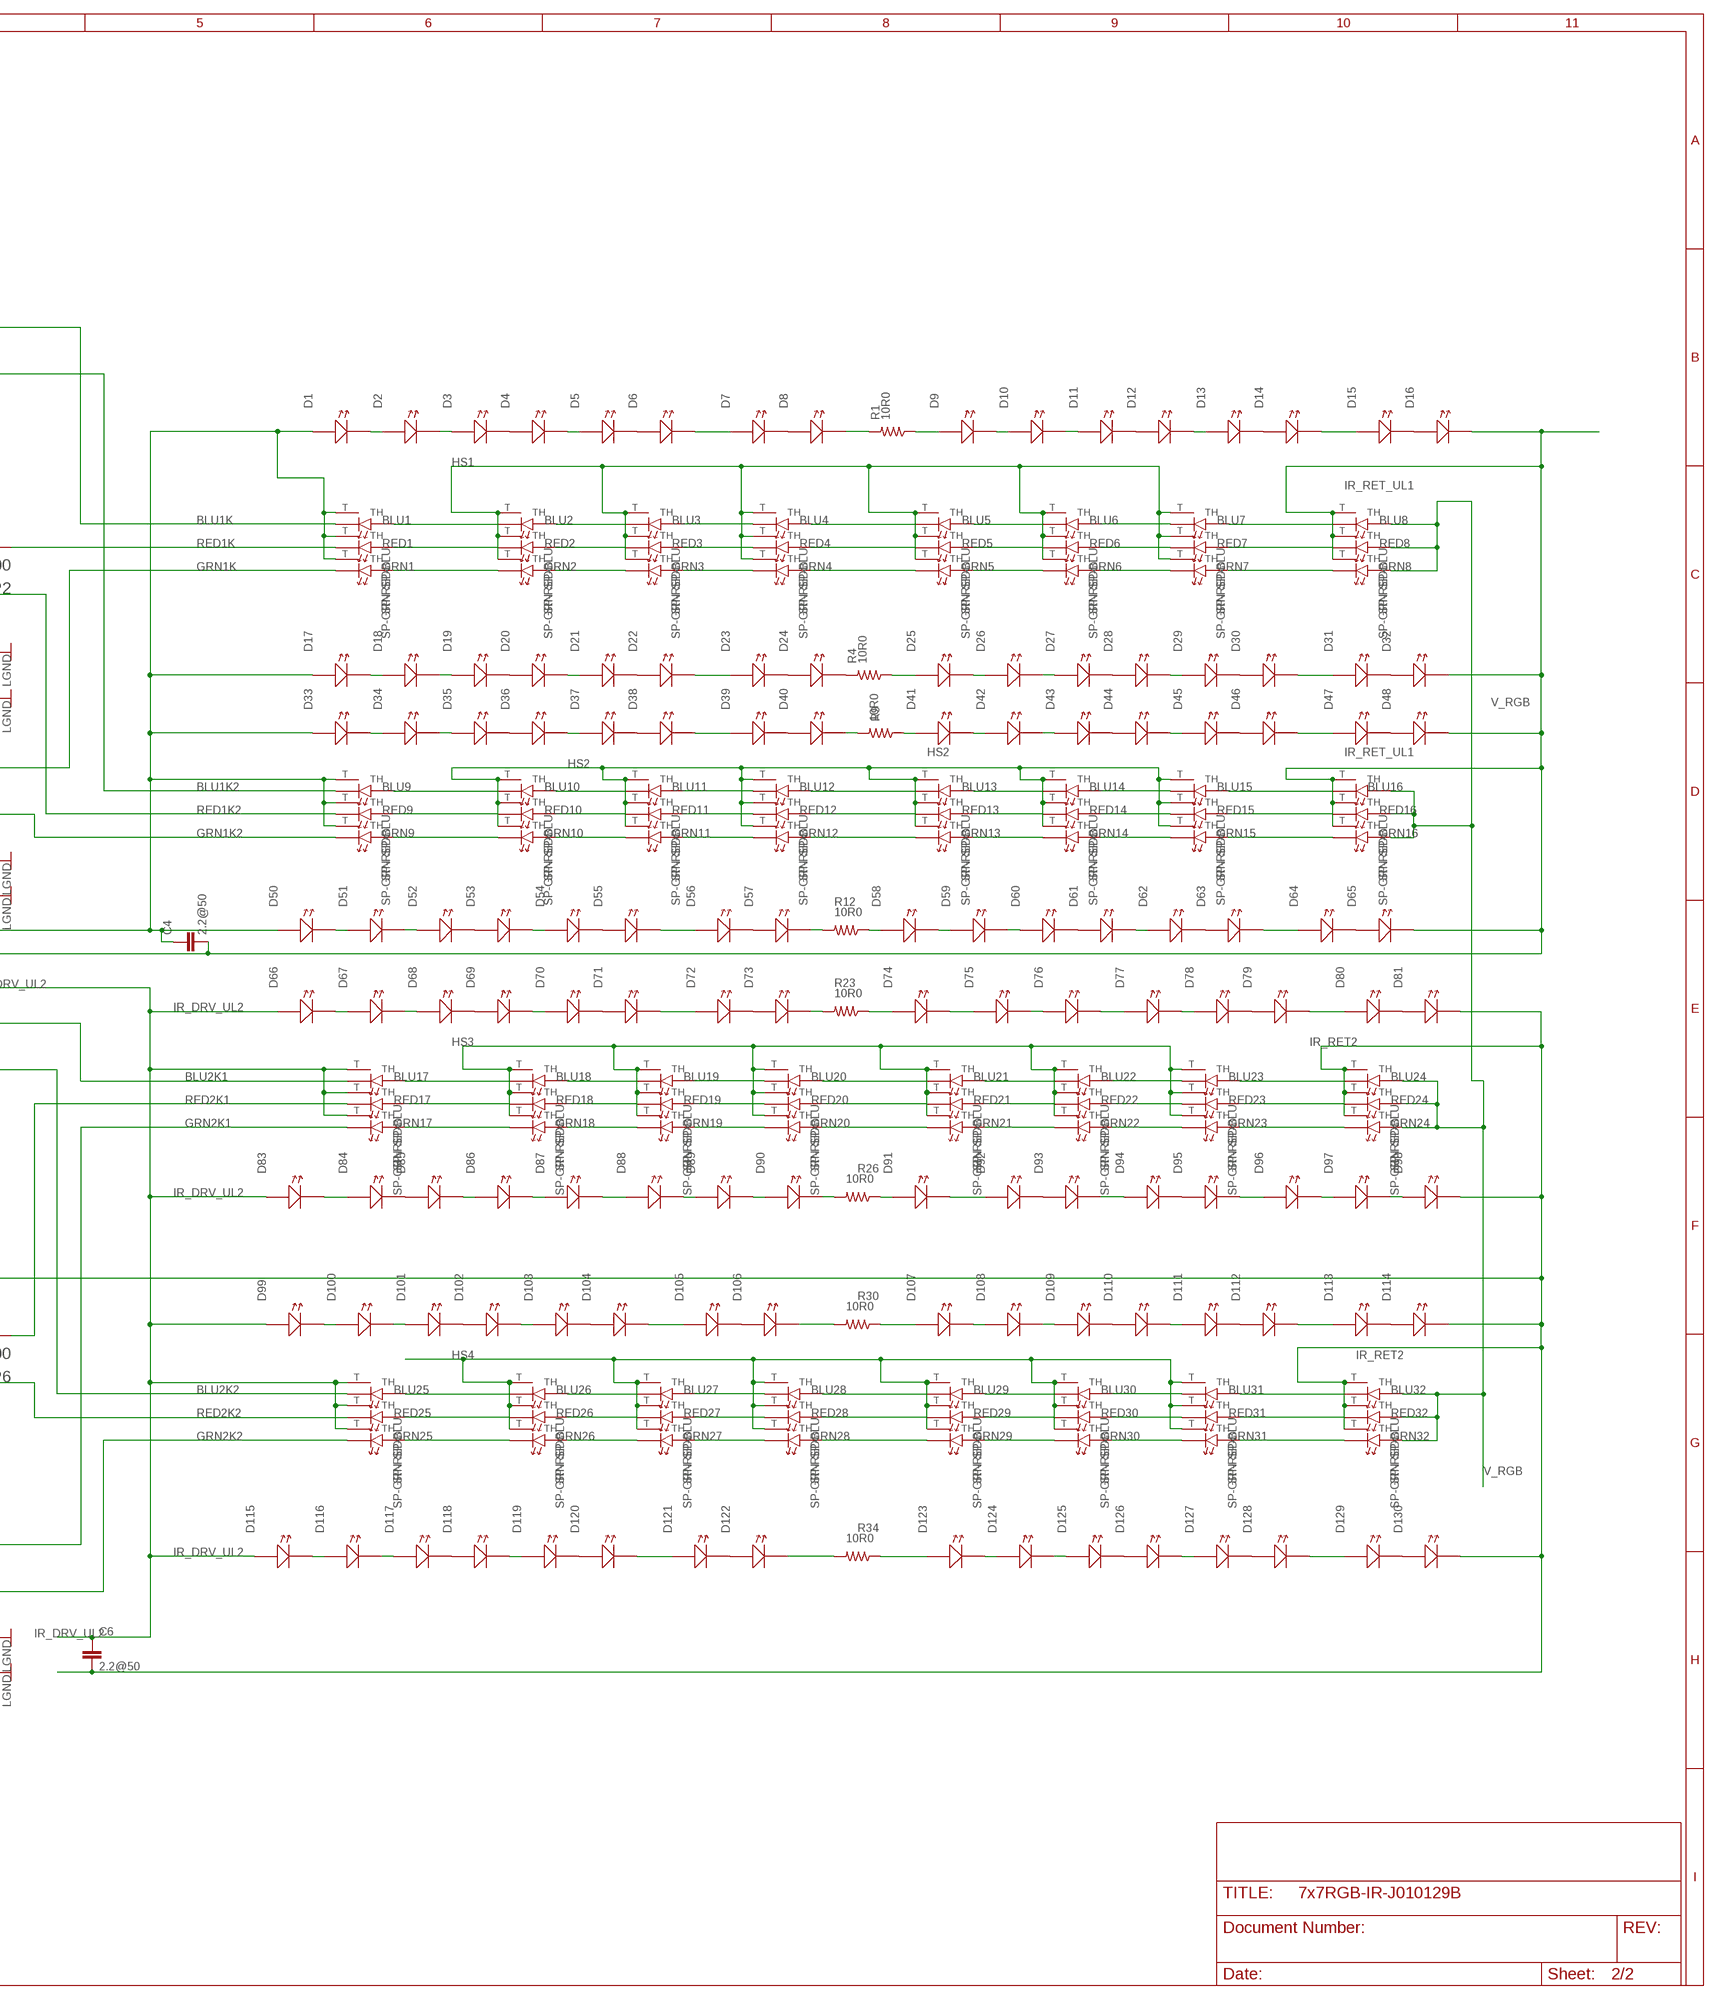
[diagram p3: schematic, sheet 2, part 2 of 2]

### Parts
BLU1  SP-BLU  LED-TH  [SUNPLUS-LED]
BLU2  SP-BLU  LED-TH  [SUNPLUS-LED]
BLU3  SP-BLU  LED-TH  [SUNPLUS-LED]
BLU4  SP-BLU  LED-TH  [SUNPLUS-LED]
BLU5  SP-BLU  LED-TH  [SUNPLUS-LED]
BLU6  SP-BLU  LED-TH  [SUNPLUS-LED]
BLU7  SP-BLU  LED-TH  [SUNPLUS-LED]
BLU8  SP-BLU  LED-TH  [SUNPLUS-LED]
BLU9  SP-BLU  LED-TH  [SUNPLUS-LED]
BLU10  SP-BLU  LED-TH  [SUNPLUS-LED]
BLU11  SP-BLU  LED-TH  [SUNPLUS-LED]
BLU12  SP-BLU  LED-TH  [SUNPLUS-LED]
BLU13  SP-BLU  LED-TH  [SUNPLUS-LED]
BLU14  SP-BLU  LED-TH  [SUNPLUS-LED]
BLU15  SP-BLU  LED-TH  [SUNPLUS-LED]
BLU16  SP-BLU  LED-TH  [SUNPLUS-LED]
BLU17  SP-BLU  LED-TH  [SUNPLUS-LED]
BLU18  SP-BLU  LED-TH  [SUNPLUS-LED]
BLU19  SP-BLU  LED-TH  [SUNPLUS-LED]
BLU20  SP-BLU  LED-TH  [SUNPLUS-LED]
BLU21  SP-BLU  LED-TH  [SUNPLUS-LED]
BLU22  SP-BLU  LED-TH  [SUNPLUS-LED]
BLU23  SP-BLU  LED-TH  [SUNPLUS-LED]
BLU24  SP-BLU  LED-TH  [SUNPLUS-LED]
BLU25  SP-BLU  LED-TH  [SUNPLUS-LED]
BLU26  SP-BLU  LED-TH  [SUNPLUS-LED]
BLU27  SP-BLU  LED-TH  [SUNPLUS-LED]
BLU28  SP-BLU  LED-TH  [SUNPLUS-LED]
BLU29  SP-BLU  LED-TH  [SUNPLUS-LED]
BLU30  SP-BLU  LED-TH  [SUNPLUS-LED]
BLU31  SP-BLU  LED-TH  [SUNPLUS-LED]
BLU32  SP-BLU  LED-TH  [SUNPLUS-LED]
C1  CPOL-US153CLV-0810  [153CLV-0810]
C2  0.1  CAPS0805S  [0805S]
C3  10@50  CAPS1210S  [1210S]
C4  2.2@50  CAPS1206S  [1206S]
C5  2.2@50  CAPS1206S  [1206S]
C6  2.2@50  CAPS1206S  [1206S]
C7  10@50  CAPS1210S  [1210S]
C8  0.1  CAPS0805S  [0805S]
C9  2.2@50  CAPS1206S  [1206S]
C20  10@50  CAPS1210S  [1210S]
C21  10@50  CAPS1210S  [1210S]
D1  LEDLED_SFH4050  [LED_SFH4050]
D2  LEDLED_SFH4050  [LED_SFH4050]
D3  LEDLED_SFH4050  [LED_SFH4050]
D4  LEDLED_SFH4050  [LED_SFH4050]
D5  LEDLED_SFH4050  [LED_SFH4050]
D6  LEDLED_SFH4050  [LED_SFH4050]
D7  LEDLED_SFH4050  [LED_SFH4050]
D8  LEDLED_SFH4050  [LED_SFH4050]
D9  LEDLED_SFH4050  [LED_SFH4050]
D10  LEDLED_SFH4050  [LED_SFH4050]
D11  LEDLED_SFH4050  [LED_SFH4050]
D12  LEDLED_SFH4050  [LED_SFH4050]
D13  LEDLED_SFH4050  [LED_SFH4050]
D14  LEDLED_SFH4050  [LED_SFH4050]
D15  LEDLED_SFH4050  [LED_SFH4050]
D16  LEDLED_SFH4050  [LED_SFH4050]
D17  LEDLED_SFH4050  [LED_SFH4050]
D18  LEDLED_SFH4050  [LED_SFH4050]
D19  LEDLED_SFH4050  [LED_SFH4050]
D20  LEDLED_SFH4050  [LED_SFH4050]
D21  LEDLED_SFH4050  [LED_SFH4050]
D22  LEDLED_SFH4050  [LED_SFH4050]
D23  LEDLED_SFH4050  [LED_SFH4050]
D24  LEDLED_SFH4050  [LED_SFH4050]
D25  LEDLED_SFH4050  [LED_SFH4050]
D26  LEDLED_SFH4050  [LED_SFH4050]
D27  LEDLED_SFH4050  [LED_SFH4050]
D28  LEDLED_SFH4050  [LED_SFH4050]
D29  LEDLED_SFH4050  [LED_SFH4050]
D30  LEDLED_SFH4050  [LED_SFH4050]
D31  LEDLED_SFH4050  [LED_SFH4050]
D32  LEDLED_SFH4050  [LED_SFH4050]
D33  LEDLED_SFH4050  [LED_SFH4050]
D34  LEDLED_SFH4050  [LED_SFH4050]
D35  LEDLED_SFH4050  [LED_SFH4050]
D36  LEDLED_SFH4050  [LED_SFH4050]
D37  LEDLED_SFH4050  [LED_SFH4050]
D38  LEDLED_SFH4050  [LED_SFH4050]
D39  LEDLED_SFH4050  [LED_SFH4050]
D40  LEDLED_SFH4050  [LED_SFH4050]
D41  LEDLED_SFH4050  [LED_SFH4050]
D42  LEDLED_SFH4050  [LED_SFH4050]
D43  LEDLED_SFH4050  [LED_SFH4050]
D44  LEDLED_SFH4050  [LED_SFH4050]
D45  LEDLED_SFH4050  [LED_SFH4050]
D46  LEDLED_SFH4050  [LED_SFH4050]
D47  LEDLED_SFH4050  [LED_SFH4050]
D48  LEDLED_SFH4050  [LED_SFH4050]
D49  DLFS240L  DIODE_SCHOTTKYPWRDI-123  [PWRDI-123]
D50  LEDLED_SFH4050  [LED_SFH4050]
D51  LEDLED_SFH4050  [LED_SFH4050]
D52  LEDLED_SFH4050  [LED_SFH4050]
D53  LEDLED_SFH4050  [LED_SFH4050]
D54  LEDLED_SFH4050  [LED_SFH4050]
D55  LEDLED_SFH4050  [LED_SFH4050]
D56  LEDLED_SFH4050  [LED_SFH4050]
D57  LEDLED_SFH4050  [LED_SFH4050]
D58  LEDLED_SFH4050  [LED_SFH4050]
D59  LEDLED_SFH4050  [LED_SFH4050]
D60  LEDLED_SFH4050  [LED_SFH4050]
D61  LEDLED_SFH4050  [LED_SFH4050]
D62  LEDLED_SFH4050  [LED_SFH4050]
D63  LEDLED_SFH4050  [LED_SFH4050]
D64  LEDLED_SFH4050  [LED_SFH4050]
D65  LEDLED_SFH4050  [LED_SFH4050]
D66  LEDLED_SFH4050  [LED_SFH4050]
D67  LEDLED_SFH4050  [LED_SFH4050]
D68  LEDLED_SFH4050  [LED_SFH4050]
D69  LEDLED_SFH4050  [LED_SFH4050]
D70  LEDLED_SFH4050  [LED_SFH4050]
D71  LEDLED_SFH4050  [LED_SFH4050]
D72  LEDLED_SFH4050  [LED_SFH4050]
D73  LEDLED_SFH4050  [LED_SFH4050]
D74  LEDLED_SFH4050  [LED_SFH4050]
D75  LEDLED_SFH4050  [LED_SFH4050]
D76  LEDLED_SFH4050  [LED_SFH4050]
D77  LEDLED_SFH4050  [LED_SFH4050]
D78  LEDLED_SFH4050  [LED_SFH4050]
D79  LEDLED_SFH4050  [LED_SFH4050]
D80  LEDLED_SFH4050  [LED_SFH4050]
D81  LEDLED_SFH4050  [LED_SFH4050]
D82  DLFS240L  DIODE_SCHOTTKYPWRDI-123  [PWRDI-123]
D83  LEDLED_SFH4050  [LED_SFH4050]
D84  LEDLED_SFH4050  [LED_SFH4050]
D85  LEDLED_SFH4050  [LED_SFH4050]
D86  LEDLED_SFH4050  [LED_SFH4050]
D87  LEDLED_SFH4050  [LED_SFH4050]
D88  LEDLED_SFH4050  [LED_SFH4050]
D89  LEDLED_SFH4050  [LED_SFH4050]
D90  LEDLED_SFH4050  [LED_SFH4050]
D91  LEDLED_SFH4050  [LED_SFH4050]
D92  LEDLED_SFH4050  [LED_SFH4050]
D93  LEDLED_SFH4050  [LED_SFH4050]
D94  LEDLED_SFH4050  [LED_SFH4050]
D95  LEDLED_SFH4050  [LED_SFH4050]
D96  LEDLED_SFH4050  [LED_SFH4050]
D97  LEDLED_SFH4050  [LED_SFH4050]
D98  LEDLED_SFH4050  [LED_SFH4050]
D99  LEDLED_SFH4050  [LED_SFH4050]
D100  LEDLED_SFH4050  [LED_SFH4050]
D101  LEDLED_SFH4050  [LED_SFH4050]
D102  LEDLED_SFH4050  [LED_SFH4050]
D103  LEDLED_SFH4050  [LED_SFH4050]
D104  LEDLED_SFH4050  [LED_SFH4050]
D105  LEDLED_SFH4050  [LED_SFH4050]
D106  LEDLED_SFH4050  [LED_SFH4050]
D107  LEDLED_SFH4050  [LED_SFH4050]
D108  LEDLED_SFH4050  [LED_SFH4050]
D109  LEDLED_SFH4050  [LED_SFH4050]
D110  LEDLED_SFH4050  [LED_SFH4050]
D111  LEDLED_SFH4050  [LED_SFH4050]
D112  LEDLED_SFH4050  [LED_SFH4050]
D113  LEDLED_SFH4050  [LED_SFH4050]
D114  LEDLED_SFH4050  [LED_SFH4050]
D115  LEDLED_SFH4050  [LED_SFH4050]
D116  LEDLED_SFH4050  [LED_SFH4050]
D117  LEDLED_SFH4050  [LED_SFH4050]
D118  LEDLED_SFH4050  [LED_SFH4050]
D119  LEDLED_SFH4050  [LED_SFH4050]
D120  LEDLED_SFH4050  [LED_SFH4050]
D121  LEDLED_SFH4050  [LED_SFH4050]
D122  LEDLED_SFH4050  [LED_SFH4050]
D123  LEDLED_SFH4050  [LED_SFH4050]
D124  LEDLED_SFH4050  [LED_SFH4050]
D125  LEDLED_SFH4050  [LED_SFH4050]
D126  LEDLED_SFH4050  [LED_SFH4050]
D127  LEDLED_SFH4050  [LED_SFH4050]
D128  LEDLED_SFH4050  [LED_SFH4050]
D129  LEDLED_SFH4050  [LED_SFH4050]
D130  LEDLED_SFH4050  [LED_SFH4050]
GRN1  SP-GRN  LED-TH  [SUNPLUS-LED]
GRN2  SP-GRN  LED-TH  [SUNPLUS-LED]
GRN3  SP-GRN  LED-TH  [SUNPLUS-LED]
GRN4  SP-GRN  LED-TH  [SUNPLUS-LED]
GRN5  SP-GRN  LED-TH  [SUNPLUS-LED]
GRN6  SP-GRN  LED-TH  [SUNPLUS-LED]
GRN7  SP-GRN  LED-TH  [SUNPLUS-LED]
GRN8  SP-GRN  LED-TH  [SUNPLUS-LED]
GRN9  SP-GRN  LED-TH  [SUNPLUS-LED]
GRN10  SP-GRN  LED-TH  [SUNPLUS-LED]
GRN11  SP-GRN  LED-TH  [SUNPLUS-LED]
GRN12  SP-GRN  LED-TH  [SUNPLUS-LED]
GRN13  SP-GRN  LED-TH  [SUNPLUS-LED]
GRN14  SP-GRN  LED-TH  [SUNPLUS-LED]
GRN15  SP-GRN  LED-TH  [SUNPLUS-LED]
GRN16  SP-GRN  LED-TH  [SUNPLUS-LED]
GRN17  SP-GRN  LED-TH  [SUNPLUS-LED]
GRN18  SP-GRN  LED-TH  [SUNPLUS-LED]
GRN19  SP-GRN  LED-TH  [SUNPLUS-LED]
GRN20  SP-GRN  LED-TH  [SUNPLUS-LED]
GRN21  SP-GRN  LED-TH  [SUNPLUS-LED]
GRN22  SP-GRN  LED-TH  [SUNPLUS-LED]
GRN23  SP-GRN  LED-TH  [SUNPLUS-LED]
GRN24  SP-GRN  LED-TH  [SUNPLUS-LED]
GRN25  SP-GRN  LED-TH  [SUNPLUS-LED]
GRN26  SP-GRN  LED-TH  [SUNPLUS-LED]
GRN27  SP-GRN  LED-TH  [SUNPLUS-LED]
GRN28  SP-GRN  LED-TH  [SUNPLUS-LED]
GRN29  SP-GRN  LED-TH  [SUNPLUS-LED]
GRN30  SP-GRN  LED-TH  [SUNPLUS-LED]
GRN31  SP-GRN  LED-TH  [SUNPLUS-LED]
GRN32  SP-GRN  LED-TH  [SUNPLUS-LED]
JMP1  JUMPER5100  [5100]
JMP2  JUMPER5100  [5100]
JMP4  JUMPER5100  [5100]
JMP5  JUMPER5100  [5100]
JMP6  JUMPER5100  [5100]
JMP7  JUMPER5100  [5100]
JMP14  JUMPER5100  [5100]
JMP15  JUMPER5100  [5100]
JMP18  JUMPER5100  [5100]
JMP19  JUMPER5100  [5100]
L1  68uH/1A  INDUCTOR_SMSRU8043  [SRU8043]
L2  68uH/1A  INDUCTOR_SMSRU8043  [SRU8043]
P1  CON162X8SM-SMALL  [HEADER2X8_SM_SMALL]
P4  CON2X3  [2X3_PLUG]
Q1  NPN_DUAL  [LFPAK56D]
Q2  NPN_DUAL  [LFPAK56D]
Q3  NPN_DUAL  [LFPAK56D]
Q4  NPN_DUAL  [LFPAK56D]
Q5  NPN_DUAL  [LFPAK56D]
Q6  NPN_DUAL  [LFPAK56D]
R1  10R0  RESISTOR_SM1206S  [1206S]
R2  10K0  RESISTOR_SM1206S  [1206S]
R3  4R99  R-US_R2512  [R2512]
R4  10R0  RESISTOR_SM1206S  [1206S]
R5  4R99  R-US_R2512  [R2512]
R6  0R0  RESISTOR_SM1206S  [1206S]
R7  4R99  R-US_R2512  [R2512]
R8  10K0  RESISTOR_SM1206S  [1206S]
R9  10R0  RESISTOR_SM1206S  [1206S]
R10  4R99  R-US_R2512  [R2512]
R11  4R99  R-US_R2512  [R2512]
R12  10R0  RESISTOR_SM1206S  [1206S]
R13  4R99  R-US_R2512  [R2512]
R14  4.99K  RESISTOR_SM0805S  [0805S]
R16  1R00  RESISTOR_SM1206S  [1206S]
R17  0R0  RESISTOR_SM1206S  [1206S]
R18  0R0  RESISTOR_SM1206S  [1206S]
R19  1R00  RESISTOR_SM1206S  [1206S]
R20  4.99K  RESISTOR_SM0805S  [0805S]
R21  0R0  RESISTOR_SM1206S  [1206S]
R22  4R99  R-US_R2512  [R2512]
R23  10R0  RESISTOR_SM1206S  [1206S]
R24  4R99  R-US_R2512  [R2512]
R25  4R99  R-US_R2512  [R2512]
R26  10R0  RESISTOR_SM1206S  [1206S]
R27  4R99  R-US_R2512  [R2512]
R28  0R0  RESISTOR_SM1206S  [1206S]
R29  4R99  R-US_R2512  [R2512]
R30  10R0  RESISTOR_SM1206S  [1206S]
R31  0R0  RESISTOR_SM1206S  [1206S]
R32  4R99  R-US_R2512  [R2512]
R33  0R0  RESISTOR_SM1206S  [1206S]
R34  10R0  RESISTOR_SM1206S  [1206S]
RED1  SP-RED  LED-TH  [SUNPLUS-LED]
RED2  SP-RED  LED-TH  [SUNPLUS-LED]
RED3  SP-RED  LED-TH  [SUNPLUS-LED]
RED4  SP-RED  LED-TH  [SUNPLUS-LED]
RED5  SP-RED  LED-TH  [SUNPLUS-LED]
RED6  SP-RED  LED-TH  [SUNPLUS-LED]
RED7  SP-RED  LED-TH  [SUNPLUS-LED]
RED8  SP-RED  LED-TH  [SUNPLUS-LED]
RED9  SP-RED  LED-TH  [SUNPLUS-LED]
RED10  SP-RED  LED-TH  [SUNPLUS-LED]
RED11  SP-RED  LED-TH  [SUNPLUS-LED]
RED12  SP-RED  LED-TH  [SUNPLUS-LED]
RED13  SP-RED  LED-TH  [SUNPLUS-LED]
RED14  SP-RED  LED-TH  [SUNPLUS-LED]
RED15  SP-RED  LED-TH  [SUNPLUS-LED]
RED16  SP-RED  LED-TH  [SUNPLUS-LED]
RED17  SP-RED  LED-TH  [SUNPLUS-LED]
RED18  SP-RED  LED-TH  [SUNPLUS-LED]
RED19  SP-RED  LED-TH  [SUNPLUS-LED]
RED20  SP-RED  LED-TH  [SUNPLUS-LED]
RED21  SP-RED  LED-TH  [SUNPLUS-LED]
RED22  SP-RED  LED-TH  [SUNPLUS-LED]
RED23  SP-RED  LED-TH  [SUNPLUS-LED]
RED24  SP-RED  LED-TH  [SUNPLUS-LED]
RED25  SP-RED  LED-TH  [SUNPLUS-LED]
RED26  SP-RED  LED-TH  [SUNPLUS-LED]
RED27  SP-RED  LED-TH  [SUNPLUS-LED]
RED28  SP-RED  LED-TH  [SUNPLUS-LED]
RED29  SP-RED  LED-TH  [SUNPLUS-LED]
RED30  SP-RED  LED-TH  [SUNPLUS-LED]
RED31  SP-RED  LED-TH  [SUNPLUS-LED]
RED32  SP-RED  LED-TH  [SUNPLUS-LED]
U1  AP8802  [SOIC8-EP]
U2  AP8802  [SOIC8-EP]

### Nets
BLU1: P1.16 Q1.4(B2) R2.1
BLU1F: P1.14 Q1.3(E2) R5.2
BLU1K: BLU1.GC(K) Q1.7(C1) Q1.8(C1) Q1.78(C1)
BLU1K2: BLU9.GC(K) Q1.5(C2) Q1.6(C2) Q1.56(C2)
BLU2: P1.3 Q4.2(B1) R28.2
BLU2F: P1.5 Q4.1(E1) R22.2
BLU2K1: BLU17.GC(K) Q4.7(C1) Q4.8(C1) Q4.78(C1)
BLU2K2: BLU25.GC(K) Q4.5(C2) Q4.6(C2) Q4.56(C2)
G1: Q5.3(E2) R27.2
G4A1: Q5.4(B2) R31.1
GRN1: P1.15 Q2.4(B2) R6.1
GRN1F: P1.13 Q2.3(E2) R10.2
GRN1K: GRN1.GC(K) JMP1.1
GRN1K2: GRN9.GC(K) Q2.5(C2) Q2.6(C2) Q2.56(C2)
GRN2: P1.2 Q5.2(B1) R31.2
GRN2F: P1.1 Q5.1(E1) R25.2
GRN2K1: GRN17.GC(K) JMP4.1
GRN2K2: GRN25.GC(K) Q5.5(C2) Q5.6(C2) Q5.56(C2)
HS1: BLU2.T(TH) BLU3.T(TH) BLU4.T(TH) BLU5.T(TH) BLU6.T(TH) BLU7.T(TH) GRN2.T(TH) GRN3.T(TH) GRN4.T(TH) GRN5.T(TH) GRN6.T(TH) GRN7.T(TH) RED2.T(TH) RED3.T(TH) RED4.T(TH) RED5.T(TH) RED6.T(TH) RED7.T(TH)
HS2: BLU10.T(TH) BLU11.T(TH) BLU12.T(TH) BLU13.T(TH) BLU14.T(TH) BLU15.T(TH) GRN10.T(TH) GRN11.T(TH) GRN12.T(TH) GRN13.T(TH) GRN14.T(TH) GRN15.T(TH) RED10.T(TH) RED11.T(TH) RED12.T(TH) RED13.T(TH) RED14.T(TH) RED15.T(TH)
HS3: BLU18.T(TH) BLU19.T(TH) BLU20.T(TH) BLU21.T(TH) BLU22.T(TH) BLU23.T(TH) GRN18.T(TH) GRN19.T(TH) GRN20.T(TH) GRN21.T(TH) GRN22.T(TH) GRN23.T(TH) RED18.T(TH) RED19.T(TH) RED20.T(TH) RED21.T(TH) RED22.T(TH) RED23.T(TH)
HS4: BLU26.T(TH) BLU27.T(TH) BLU28.T(TH) BLU29.T(TH) BLU30.T(TH) BLU31.T(TH) GRN26.T(TH) GRN27.T(TH) GRN28.T(TH) GRN29.T(TH) GRN30.T(TH) GRN31.T(TH) RED26.T(TH) RED27.T(TH) RED28.T(TH) RED29.T(TH) RED30.T(TH) RED31.T(TH)
IGND1: C2.2 C3.2 C7.2 C8.2 C20.2 C21.2 JMP18.1 JMP18.2 JMP19.1 JMP19.2 R14.1 R17.2 R20.1 U1.2(GND) U1.7(GND1) U1.EP U2.2(GND) U2.7(GND1) U2.EP
IR_1: P1.9 R14.2 U1.8(CTRL)
IR_2: P1.7 R20.2 U2.8(CTRL)
IR_DRV_UL1: BLU1.T(TH) BLU9.T(TH) C4.1 C5.1 D1.A D17.A D33.A D50.A GRN1.T(TH) GRN9.T(TH) R16.1 RED1.T(TH) RED9.T(TH) U1.1(SET)
IR_DRV_UL2: BLU17.T(TH) BLU25.T(TH) C6.1 C9.1 D66.A D83.A D99.A D115.A GRN17.T(TH) GRN25.T(TH) R19.1 RED17.T(TH) RED25.T(TH) U2.1(SET)
IR_RET2: BLU24.T(TH) BLU32.T(TH) C6.2 D81.C(K) D98.C(K) D114.C(K) D130.C(K) GRN24.T(TH) GRN32.T(TH) R21.2 RED24.T(TH) RED32.T(TH)
IR_RET_UL1: BLU8.T(TH) BLU16.T(TH) C4.2 C5.2 D16.C(K) D32.C(K) D48.C(K) D65.C(K) GRN8.T(TH) GRN16.T(TH) L1.1 RED8.T(TH) RED16.T(TH)
LGND: C1.- P1.8 P1.10 P4.1 P4.3 R3.1 R5.1 R7.1 R10.1 R11.1 R13.1 R17.1 R22.1 R24.1 R25.1 R27.1 R29.1 R32.1 ; also sheet 1
N$1: GRN10.GA(A) GRN11.GC(K)
N$7: GRN9.GA(A) GRN10.GC(K)
N$12: RED10.GA(A) RED11.GC(K)
N$13: RED9.GA(A) RED10.GC(K)
N$28: GRN5.GA(A) GRN6.GC(K)
N$40: BLU9.GA(A) BLU10.GC(K)
N$41: BLU10.GA(A) BLU11.GC(K)
N$42: GRN13.GA(A) GRN14.GC(K)
N$43: GRN12.GA(A) GRN13.GC(K)
N$44: RED13.GA(A) RED14.GC(K)
N$45: RED12.GA(A) RED13.GC(K)
N$46: BLU12.GA(A) BLU13.GC(K)
N$47: BLU13.GA(A) BLU14.GC(K)
N$48: GRN15.GA(A) GRN16.GC(K)
N$49: RED15.GA(A) RED16.GC(K)
N$50: BLU15.GA(A) BLU16.GC(K)
N$51: BLU11.GA(A) BLU12.GC(K)
N$52: RED11.GA(A) RED12.GC(K)
N$53: GRN11.GA(A) GRN12.GC(K)
N$54: GRN18.GA(A) GRN19.GC(K)
N$55: BLU14.GA(A) BLU15.GC(K)
N$56: RED14.GA(A) RED15.GC(K)
N$57: D51.C(K) D52.A
N$58: D52.C(K) D53.A
N$59: D54.C(K) D55.A
N$60: D56.C(K) D57.A
N$61: D50.C(K) D51.A
N$62: D53.C(K) D54.A
N$63: D55.C(K) D56.A
N$64: D59.C(K) D60.A
N$65: D60.C(K) D61.A
N$66: D62.C(K) D63.A
N$68: D64.C(K) D65.A
N$69: D58.C(K) D59.A
N$70: D61.C(K) D62.A
N$71: D63.C(K) D64.A
N$72: D34.C(K) D35.A
N$73: D35.C(K) D36.A
N$74: D37.C(K) D38.A
N$75: D39.C(K) D40.A
N$76: D33.C(K) D34.A
N$77: D36.C(K) D37.A
N$78: D38.C(K) D39.A
N$79: D42.C(K) D43.A
N$80: D43.C(K) D44.A
N$81: D45.C(K) D46.A
N$82: D47.C(K) D48.A
N$83: D41.C(K) D42.A
N$84: D44.C(K) D45.A
N$85: D46.C(K) D47.A
N$86: GRN17.GA(A) GRN18.GC(K)
N$87: RED18.GA(A) RED19.GC(K)
N$88: RED17.GA(A) RED18.GC(K)
N$89: BLU17.GA(A) BLU18.GC(K)
N$90: BLU18.GA(A) BLU19.GC(K)
N$91: GRN21.GA(A) GRN22.GC(K)
N$92: GRN20.GA(A) GRN21.GC(K)
N$93: RED21.GA(A) RED22.GC(K)
N$94: RED20.GA(A) RED21.GC(K)
N$95: BLU20.GA(A) BLU21.GC(K)
N$96: BLU21.GA(A) BLU22.GC(K)
N$98: GRN23.GA(A) GRN24.GC(K)
N$99: RED23.GA(A) RED24.GC(K)
N$100: BLU23.GA(A) BLU24.GC(K)
N$101: BLU19.GA(A) BLU20.GC(K)
N$102: RED19.GA(A) RED20.GC(K)
N$103: GRN19.GA(A) GRN20.GC(K)
N$104: GRN26.GA(A) GRN27.GC(K)
N$105: BLU22.GA(A) BLU23.GC(K)
N$106: RED22.GA(A) RED23.GC(K)
N$107: GRN22.GA(A) GRN23.GC(K)
N$108: D67.C(K) D68.A
N$109: D68.C(K) D69.A
N$110: D70.C(K) D71.A
N$111: D72.C(K) D73.A
N$112: D66.C(K) D67.A
N$113: D69.C(K) D70.A
N$114: D71.C(K) D72.A
N$115: D75.C(K) D76.A
N$116: D76.C(K) D77.A
N$117: D78.C(K) D79.A
N$118: D80.C(K) D81.A
N$119: D74.C(K) D75.A
N$120: D77.C(K) D78.A
N$121: D79.C(K) D80.A
N$122: D84.C(K) D85.A
N$123: D85.C(K) D86.A
N$124: D87.C(K) D88.A
N$125: D89.C(K) D90.A
N$126: D83.C(K) D84.A
N$127: D86.C(K) D87.A
N$128: D88.C(K) D89.A
N$129: D92.C(K) D93.A
N$130: D94.C(K) D95.A
N$131: D96.C(K) D97.A
N$132: D91.C(K) D92.A
N$133: D93.C(K) D94.A
N$134: D95.C(K) D96.A
N$135: GRN4.GA(A) GRN5.GC(K)
N$136: RED5.GA(A) RED6.GC(K)
N$137: RED4.GA(A) RED5.GC(K)
N$138: BLU4.GA(A) BLU5.GC(K)
N$139: BLU5.GA(A) BLU6.GC(K)
N$140: GRN2.GA(A) GRN3.GC(K)
N$141: GRN1.GA(A) GRN2.GC(K)
N$142: GRN7.GA(A) GRN8.GC(K)
N$143: RED7.GA(A) RED8.GC(K)
N$144: BLU7.GA(A) BLU8.GC(K)
N$145: BLU3.GA(A) BLU4.GC(K)
N$146: RED3.GA(A) RED4.GC(K)
N$147: RED2.GA(A) RED3.GC(K)
N$148: RED1.GA(A) RED2.GC(K)
N$149: BLU1.GA(A) BLU2.GC(K)
N$150: BLU2.GA(A) BLU3.GC(K)
N$151: GRN3.GA(A) GRN4.GC(K)
N$152: GRN14.GA(A) GRN15.GC(K)
N$153: BLU6.GA(A) BLU7.GC(K)
N$154: RED6.GA(A) RED7.GC(K)
N$155: GRN6.GA(A) GRN7.GC(K)
N$156: D2.C(K) D3.A
N$157: D3.C(K) D4.A
N$158: D5.C(K) D6.A
N$159: D7.C(K) D8.A
N$160: D1.C(K) D2.A
N$161: D4.C(K) D5.A
N$162: D6.C(K) D7.A
N$163: D10.C(K) D11.A
N$164: D11.C(K) D12.A
N$165: D13.C(K) D14.A
N$166: D15.C(K) D16.A
N$167: D9.C(K) D10.A
N$168: D12.C(K) D13.A
N$169: D14.C(K) D15.A
N$170: D18.C(K) D19.A
N$171: D19.C(K) D20.A
N$172: D21.C(K) D22.A
N$173: D23.C(K) D24.A
N$174: D17.C(K) D18.A
N$175: D20.C(K) D21.A
N$176: D22.C(K) D23.A
N$180: D26.C(K) D27.A
N$182: D27.C(K) D28.A
N$183: D29.C(K) D30.A
N$184: D31.C(K) D32.A
N$185: D25.C(K) D26.A
N$186: D28.C(K) D29.A
N$187: D30.C(K) D31.A
N$189: Q1.1(E1) R3.2
N$191: GRN25.GA(A) GRN26.GC(K)
N$192: RED26.GA(A) RED27.GC(K)
N$193: RED25.GA(A) RED26.GC(K)
N$194: BLU25.GA(A) BLU26.GC(K)
N$195: BLU26.GA(A) BLU27.GC(K)
N$196: GRN29.GA(A) GRN30.GC(K)
N$197: GRN28.GA(A) GRN29.GC(K)
N$198: RED29.GA(A) RED30.GC(K)
N$199: RED28.GA(A) RED29.GC(K)
N$200: BLU28.GA(A) BLU29.GC(K)
N$201: BLU29.GA(A) BLU30.GC(K)
N$202: GRN31.GA(A) GRN32.GC(K)
N$203: RED31.GA(A) RED32.GC(K)
N$204: BLU31.GA(A) BLU32.GC(K)
N$205: BLU27.GA(A) BLU28.GC(K)
N$206: RED27.GA(A) RED28.GC(K)
N$207: GRN27.GA(A) GRN28.GC(K)
N$209: BLU30.GA(A) BLU31.GC(K)
N$210: RED30.GA(A) RED31.GC(K)
N$211: GRN30.GA(A) GRN31.GC(K)
N$212: D100.C(K) D101.A
N$213: D101.C(K) D102.A
N$214: D103.C(K) D104.A
N$215: D105.C(K) D106.A
N$216: D99.C(K) D100.A
N$217: D102.C(K) D103.A
N$218: D104.C(K) D105.A
N$219: D108.C(K) D109.A
N$220: D109.C(K) D110.A
N$221: D111.C(K) D112.A
N$222: D113.C(K) D114.A
N$223: D107.C(K) D108.A
N$224: D110.C(K) D111.A
N$225: D112.C(K) D113.A
N$226: D116.C(K) D117.A
N$227: D117.C(K) D118.A
N$228: D119.C(K) D120.A
N$229: D121.C(K) D122.A
N$231: D115.C(K) D116.A
N$232: D118.C(K) D119.A
N$234: D120.C(K) D121.A
N$236: D124.C(K) D125.A
N$237: D125.C(K) D126.A
N$246: D127.C(K) D128.A
N$247: D129.C(K) D130.A
N$252: D123.C(K) D124.A
N$253: D126.C(K) D127.A
N$254: D128.C(K) D129.A
N$255: JMP2.2 Q3.7(C1) Q3.8(C1) Q3.78(C1)
N$258: JMP1.2 Q2.7(C1) Q2.8(C1) Q2.78(C1)
N$259: Q1.2(B1) R2.2
N$260: D97.C(K) D98.A
N$263: JMP6.2 Q6.7(C1) Q6.8(C1) Q6.78(C1)
N$266: JMP4.2 Q5.7(C1) Q5.8(C1) Q5.78(C1)
N$293: D49.A L1.2 U1.5(SW) U1.6(SW1)
N$342: D82.A L2.2 U2.5(SW) U2.6(SW1)
N$393: C9.2 L2.1 R21.1
N$394: JMP5.1 JMP7.2
N$395: Q6.4(B2) R33.1
N$396: Q4.4(B2) R28.1
N$397: Q4.3(E2) R24.2
N$398: Q3.3(E2) R13.2
N$399: Q3.4(B2) R8.1
N$402: Q2.1(E1) R7.2
N$452: Q2.2(B1) R6.2
N$453: D9.A R1.1
N$454: D8.C(K) R1.2
N$455: D24.C(K) R4.2
N$456: D25.A R4.1
N$457: D41.A R9.1
N$458: D40.C(K) R9.2
N$459: D58.A R12.1
N$460: D57.C(K) R12.2
N$461: D73.C(K) R23.2
N$462: D74.A R23.1
N$463: D91.A R26.1
N$464: D90.C(K) R26.2
N$465: D107.A R30.1
N$466: D106.C(K) R30.2
N$467: D123.A R34.1
N$468: D122.C(K) R34.2
R1: Q6.3(E2) R32.2
RED1: P1.11 Q3.2(B1) R8.2
RED1F: P1.12 Q3.1(E1) R11.2
RED1K: JMP2.1 RED1.GC(K)
RED1K2: Q3.5(C2) Q3.6(C2) Q3.56(C2) RED9.GC(K)
RED2: P1.6 Q6.2(B1) R33.2
RED2F: P1.4 Q6.1(E1) R29.2
RED2K1: JMP6.1 RED17.GC(K)
RED2K2: Q6.5(C2) Q6.6(C2) Q6.56(C2) RED25.GC(K)
V_RGB: BLU8.GA(A) BLU16.GA(A) BLU24.GA(A) BLU32.GA(A) C1.+ GRN8.GA(A) GRN16.GA(A) GRN24.GA(A) GRN32.GA(A) JMP7.1 P4.2 P4.4 RED8.GA(A) RED16.GA(A) RED24.GA(A) RED32.GA(A) ; also sheet 1
VIR1: C2.1 C3.1 C7.1 C8.1 C20.1 C21.1 D49.K D82.K JMP5.2 JMP14.1 JMP14.2 JMP15.1 JMP15.2 R16.2 R18.1 R18.2 R19.2 U1.4(VIN) U2.4(VIN)
Unconnected: P4.5 P4.6 U1.3(N/C) U2.3(N/C)

## Library data of the parts
BLU1-BLU64 GRN1-GRN64 RED1-RED64 = RGB_IR_J010131revC:LED-TH
C1 C10 C19 = adafruit:CPOL-US: POLARIZED CAPACITOR, American symbol
C2-C9 C11-C18 C20-C23 = STEVES_BU:CAPS
D1-D48 D50-D81 D83-D178 D180-D211 D213-D260 = STEVES_BU:LED
D49 D82 D179 D212 = STEVES_BU:DIODE_SCHOTTKY
J1 = STEVES_BU:POWER_JACK_SHUNT
JMP1-JMP19 = STEVES_BU:JUMPER
L1-L4 = STEVES_BU:INDUCTOR_SM
P1 P2 = STEVES_BU:CON16
P4 = STEVES_BU:CON2X3
Q1-Q12 = STEVES_BU:NPN_DUAL
R1 R2 R4 R6 R8 R9 R12 R14 R16-R21 R23 R26 R28 R30 R31 R33-R36 R38 R40 R42 R43 R46 R48 R50-R55 R57 R60 R62 R64 R65 R67 R68 = STEVES_BU:RESISTOR_SM
R3 R5 R7 R10 R11 R13 R22 R24 R25 R27 R29 R32 R37 R39 R41 R44 R45 R47 R56 R58 R59 R61 R63 R66 = resistor:R-US_: RESISTOR, American symbol
U1-U4 = STEVES_BU:AP8802
U$19 = STEVES_BU:JFRC-LOGO